# Altium schematic sheet Block_Diagram_Safety.SchDoc
size A4; Organization: UltraZohm; SheetNumber: 42
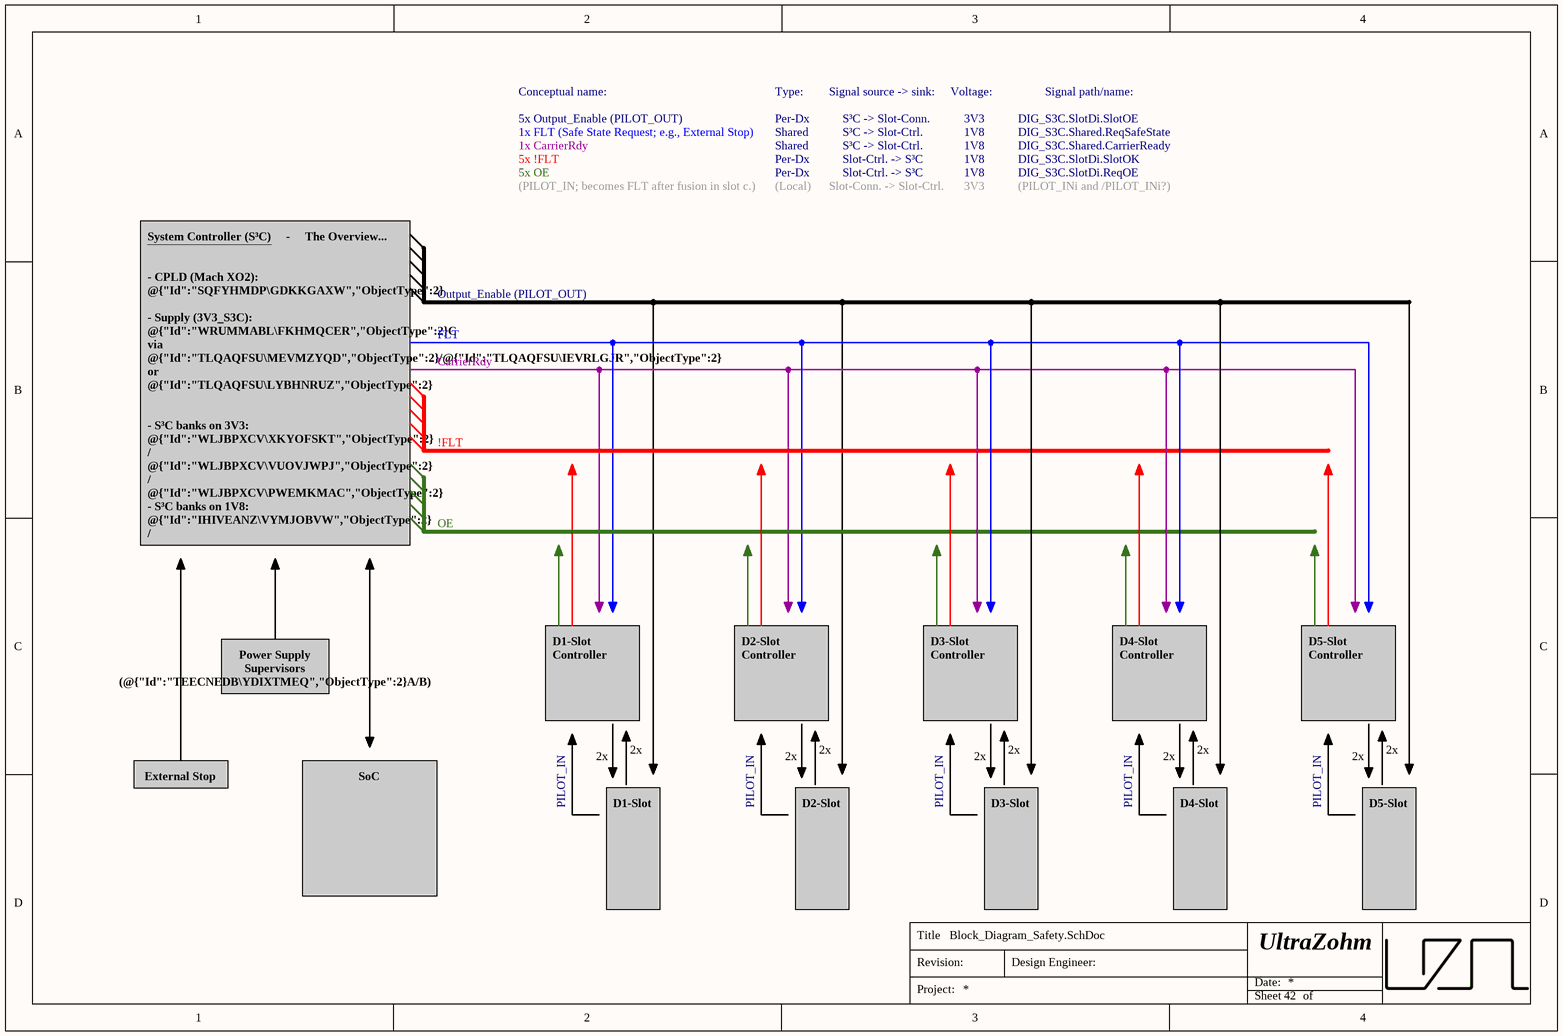
[diagram p0: Block_Diagram_Safety.SchDoc]

## Notes on the sheet
- Conceptual name:
- Type:
- Signal source -> sink:
- Voltage:
- Signal path/name:
- 5x Output_Enable (PILOT_OUT)
- 1x CarrierRdy
- 5x !FLT
- 5x OE
- 1x FLT (Safe State Request; e.g., External Stop)
- Per-Dx
- Shared
- S³C -> Slot-Ctrl.
- S³C -> Slot-Conn.
- Slot-Ctrl. -> S³C
- 3V3
- 1V8
- DIG_S3C.Shared.ReqSafeState
- DIG_S3C.Shared.CarrierReady
- DIG_S3C.SlotDi.SlotOE
- DIG_S3C.SlotDi.SlotOK
- DIG_S3C.SlotDi.ReqOE
- (PILOT_IN; becomes FLT after fusion in slot c.)
- (Local)
- Slot-Conn. -> Slot-Ctrl.
- (PILOT_INi and /PILOT_INi?)
- Output_Enable (PILOT_OUT)
- CarrierRdy
- FLT
- !FLT
- System Controller (S³C)     -     The Overview...
  ‾‾‾‾‾‾‾‾‾‾‾‾‾‾‾‾‾‾‾‾‾‾‾‾‾‾‾‾‾‾‾
  - CPLD (Mach XO2): @{"Id":"SQFYHMDP\GDKKGAXW","ObjectType":2}
  - Supply (3V3_S3C): @{"Id":"WRUMMABL\FKHMQCER","ObjectType":2}C via @{"Id":"TLQAQFSU\MEVMZYQD","ObjectType":2}/@{"Id":"TLQAQFSU\IEVRLGJR","ObjectType":2} or @{"Id":"TLQAQFSU\LYBHNRUZ","ObjectType":2}
  - S³C banks on 3V3: @{"Id":"WLJBPXCV\XKYOFSKT","ObjectType":2} / @{"Id":"WLJBPXCV\VUOVJWPJ","ObjectType":2} / @{"Id":"WLJBPXCV\PWEMKMAC","ObjectType":2}
  - S³C banks on 1V8: @{"Id":"IHIVEANZ\VYMJOBVW","ObjectType":2} / @{"Id":"IHIVEANZ\NPRHXGHB","ObjectType":2} / @{"Id":"IHIVEANZ\YWWFRIZR","ObjectType":2}
  Auxiliary circuitry (for D-slot-shared interfaces):
  - JTAG multiplexing between S³C and Dx: @{"Id":"LGRAAJOA\GWKTDCTA","ObjectType":2}
  - CS generation of PS-SPI0 (same targets): @{"Id":"KLVSJJVY\JYUMMZGZ","ObjectType":2}
  Sequencing- and safety-related remarks:
  - The card-driven "OK" signal (PILOT_IN) plus
  the slot controller's internal state (de)assert OE
  - The S³C receives 1 OE per slot, ANDs it with its
  internal state, and sets per-slot "OE"s (_OUT)
- OE
- Power Supply Supervisors
  (@{"Id":"TEECNEDB\YDIXTMEQ","ObjectType":2}A/B)
- D1-Slot Controller
- D2-Slot Controller
- D3-Slot Controller
- D4-Slot Controller
- D5-Slot Controller
- External Stop
- 2x
- PILOT_IN
- SoC
- D1-Slot
- D2-Slot
- D3-Slot
- D4-Slot
- D5-Slot
- Title
- Revision:
- Design Engineer:
- Date:
- Project:
- Sheet
- of